# Altium project MiniRacer_V2.PrjPCB
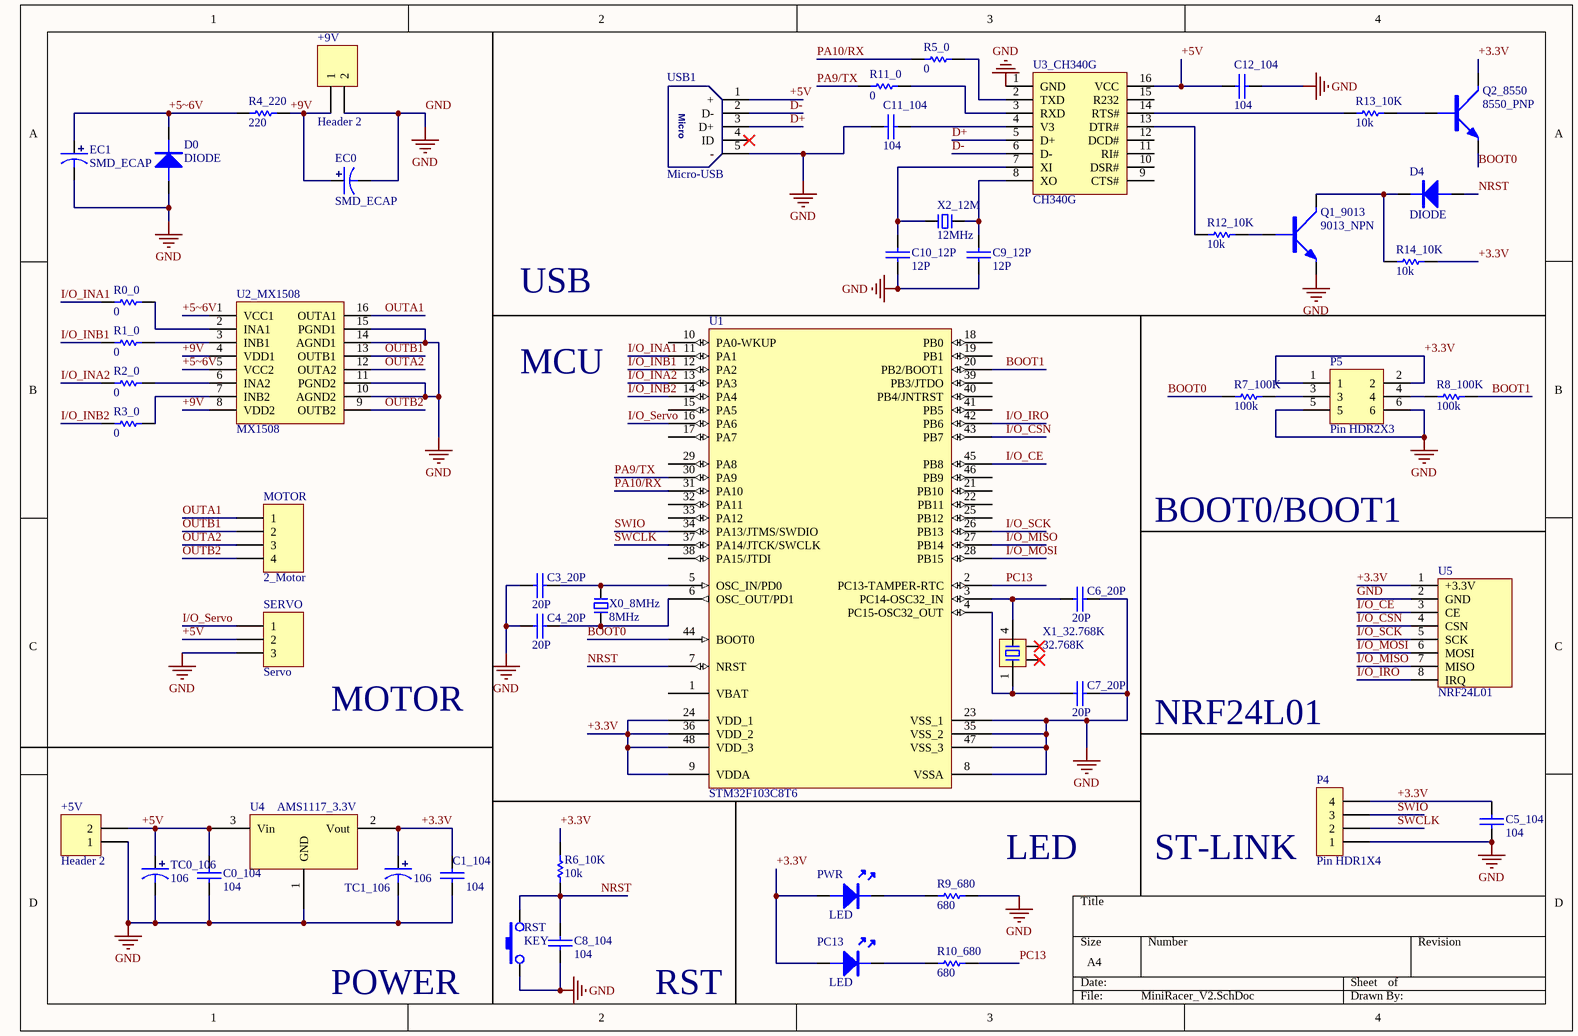
[diagram p0: MiniRacer_V2.SchDoc]
1 sheet, 53 parts. Net scope: global (net labels, ports and power ports of the same name join across sheets).
Board file: MiniRacer_V2.PcbDoc

## Sheet MiniRacer_V2.SchDoc
size A4

### Parts
+5V  Header 2  [HDR1X2]
+9V  Header 2  [HDR1X2]
C0_104  104  [0603C]
C1_104  104  [0603C]
C3_20P  20P  [0603C]
C4_20P  20P  [0603C]
C5_104  104  [0603C]
C6_20P  20P  [0603C]
C7_20P  20P  [0603C]
C8_104  104  [0603C]
C9_12P  12P  [0603C]
C10_12P  12P  [0603C]
C11_104  104  [0603C]
C12_104  104  [0603C]
D0  DIODE  [LL34]
D4  DIODE  [SOD-123]
EC0  SMD_ECAP  [SMD-EC6.3X6.3X10]
EC1  SMD_ECAP  [SMD-EC6.3X6.3X10]
MOTOR  2_Motor  [HDR1X4]
P4  Pin HDR1X4  [HDR1X4]
P5  Pin HDR2X3  [Pin HDR2X3/2.54mm-S]
PC13  LED  [LED-0603Y]
PWR  LED  [LED-0603Y]
Q1_9013  9013_NPN  [SOT-23]
Q2_8550  8550_PNP  [SOT-23]
R0_0  0  [0603R]
R1_0  0  [0603R]
R2_0  0  [0603R]
R3_0  0  [0603R]
R4_220  220  [0603R]
R5_0  0  [0603R]
R6_10K  10k  [0603R]
R7_100K  100k  [0603R]
R8_100K  100k  [0603R]
R9_680  680  [0603R]
R10_680  680  [0603R]
R11_0  0  [0603R]
R12_10K  10k  [0603R]
R13_10K  10k  [0603R]
R14_10K  10k  [0603R]
RST  KEY  [SMD-3X6X2.5]
SERVO  Servo  [HDR1X3]
TC0_106  106  [TAJ-A/3216]
TC1_106  106  [TAJ-A/3216]
U1  STM32F103C8T6  [LQFP48 7X7]
U2_MX1508  MX1508  [SOP16]
U3_CH340G  CH340G  [SOP16]
U4  AMS1117_3.3V  [SOT223]
U5  NRF24L01  [NRF24L01]
USB1  Micro-USB  [USB-MICRO_A]
X0_8MHz  8MHz  [OSC 5032-2P]
X1_32.768K  32.768K  [OSC MC-306]
X2_12M  12MHz  [OSC 5032-2P]

### Nets
GND: +5V.1 +9V.2 C0_104.1 C1_104.1 C3_20P.2 C4_20P.2 C5_104.2 C6_20P.1 C7_20P.1 C8_104.2 C9_12P.2 C10_12P.2 C11_104.2 C12_104.1 D0.A EC0.2 EC1.2 P4.1 P5.5 P5.6 Q1_9013.E R9_680.1 RST.1 SERVO.3 TC0_106.2 TC1_106.2 U1.8(VSSA) U1.23(VSS_1) U1.35(VSS_2) U1.47(VSS_3) U2_MX1508.10(AGND2) U2_MX1508.11(PGND2) U2_MX1508.14(AGND1) U2_MX1508.15(PGND1) U3_CH340G.1(GND) U4.1(GND) U5.2(GND) USB1.5(-)
+3.3V: C1_104.2 C5_104.1 P4.4 P5.1 P5.2 PC13.A PWR.A Q2_8550.C R6_10K.2 R14_10K.2 TC1_106.1 U1.9(VDDA) U1.24(VDD_1) U1.36(VDD_2) U1.48(VDD_3) U4.2(Vout) U5.1(+3.3V)
+5V: +5V.2 C0_104.2 C12_104.2 SERVO.2 TC0_106.1 U3_CH340G.16(VCC) U4.3(Vin) USB1.1(+)
+5~6V: D0.K EC1.1 R4_220.1 U2_MX1508.1(VCC1) U2_MX1508.5(VCC2)
+9V: +9V.1 EC0.1 R4_220.2 U2_MX1508.4(VDD1) U2_MX1508.8(VDD2)
BOOT0: Q2_8550.E R7_100K.2 U1.44(BOOT0)
BOOT1: R8_100K.1 U1.20(PB2/BOOT1)
D+: U3_CH340G.5(D+) USB1.3(D+)
D-: U3_CH340G.6(D-) USB1.2(D-)
I/O_CE: U1.45(PB8) U5.3(CE)
I/O_CSN: U1.43(PB7) U5.4(CSN)
I/O_INA1: R0_0.1 U1.11(PA1)
I/O_INA2: R2_0.1 U1.13(PA3)
I/O_INB1: R1_0.1 U1.12(PA2)
I/O_INB2: R3_0.1 U1.14(PA4)
I/O_IRO: U1.42(PB6) U5.8(IRQ)
I/O_MISO: U1.27(PB14) U5.7(MISO)
I/O_MOSI: U1.28(PB15) U5.6(MOSI)
I/O_SCK: U1.26(PB13) U5.5(SCK)
I/O_Servo: SERVO.1 U1.16(PA6)
NRST: C8_104.1 D4.A R6_10K.1 RST.3 U1.7(NRST)
OUTA1: MOTOR.1 U2_MX1508.16(OUTA1)
OUTA2: MOTOR.3 U2_MX1508.12(OUTA2)
OUTB1: MOTOR.2 U2_MX1508.13(OUTB1)
OUTB2: MOTOR.4 U2_MX1508.9(OUTB2)
PA9/TX: R11_0.1 U1.30(PA9)
PA10/RX: R5_0.1 U1.31(PA10)
PC13: R10_680.1 U1.2(PC13-TAMPER-RTC)
SWCLK: P4.2 U1.37(PA14/JTCK/SWCLK)
SWIO: P4.3 U1.34(PA13/JTMS/SWDIO)
NetC3_20P_1: C3_20P.1 U1.5(OSC_IN/PD0) X0_8MHz.2
NetC4_20P_1: C4_20P.1 U1.6(OSC_OUT/PD1) X0_8MHz.1
NetC6_20P_2: C6_20P.2 U1.3(PC14-OSC32_IN) X1_32.768K.4
NetC7_20P_2: C7_20P.2 U1.4(PC15-OSC32_OUT) X1_32.768K.1
NetC9_12P_1: C9_12P.1 U3_CH340G.8(XO) X2_12M.1
NetC10_12P_1: C10_12P.1 U3_CH340G.7(XI) X2_12M.2
NetC11_104_1: C11_104.1 U3_CH340G.4(V3)
NetD4_K: D4.K Q1_9013.C R14_10K.1
NetP5_3: P5.3 R7_100K.1
NetP5_4: P5.4 R8_100K.2
NetPC13_K: PC13.K R10_680.2
NetPWR_K: PWR.K R9_680.2
NetQ1_9013_B: Q1_9013.B R12_10K.2
NetQ2_8550_B: Q2_8550.B R13_10K.2
NetR0_0_2: R0_0.2 U2_MX1508.2(INA1)
NetR1_0_2: R1_0.2 U2_MX1508.3(INB1)
NetR2_0_2: R2_0.2 U2_MX1508.6(INA2)
NetR3_0_2: R3_0.2 U2_MX1508.7(INB2)
NetR5_0_2: R5_0.2 U3_CH340G.2(TXD)
NetR11_0_2: R11_0.2 U3_CH340G.3(RXD)
NetR12_10K_1: R12_10K.1 U3_CH340G.13(DTR#)
NetR13_10K_1: R13_10K.1 U3_CH340G.14(RTS#)

Not connected (* = marked no-connect by the designer): U1 1(VBAT) 10(PA0-WKUP) 15(PA5) 17(PA7) 18(PB0) 19(PB1) 21(PB10) 22(PB11) 25(PB12) 29(PA8) 32(PA11) 33(PA12) 38(PA15/JTDI) 39(PB3/JTDO) 40(PB4/JNTRST) 41(PB5) 46(PB9); U3_CH340G 9(CTS#) 10(DSR#) 11(RI#) 12(DCD#) 15(R232); USB1 4(ID)*; X1_32.768K 2* 3*

### Notes on the sheet
- USB
- MCU
- BOOT0/BOOT1
- MOTOR
- NRF24L01
- LED
- ST-LINK
- POWER
- RST
- (in symbol Micro-USB) Micro

### Library data of the parts
+5V +9V = Header 2: Header, 2-Pin; LatestRevisionDate: 17-Jul-2002; LatestRevisionNote: Re-released for DXP Platform.; Publisher: Altium Limited
C0_104 C1_104 C3_20P C4_20P C5_104 C6_20P C7_20P C8_104 C9_12P C10_12P C11_104 C12_104 = CAP: 无极性电容
D0 D4 = DIODE: 普通二极管
EC0 EC1 = SMD_ECAP: 贴片电解电容
MOTOR = Header 4: Header, 4-Pin; LatestRevisionDate: 17-Jul-2002; LatestRevisionNote: Re-released for DXP Platform.; Publisher: Altium Limited
Q1_9013 Q2_8550 = NPN: NPN三极管
R0_0 R1_0 R2_0 R3_0 R4_220 R5_0 R6_10K R7_100K R8_100K R9_680 R10_680 R11_0 R12_10K R13_10K R14_10K = RES
SERVO = Header 3: Header, 3-Pin; LatestRevisionDate: 17-Jul-2002; LatestRevisionNote: Re-released for DXP Platform.; Publisher: Altium Limited
TC0_106 TC1_106 = TCAP: 钽电容
U4 = AMS1117: 三端稳压芯片
X0_8MHz X2_12M = XTAL-2P: 2脚无源脚晶振
X1_32.768K = XTAL-MC-4P: MC系列4脚晶振